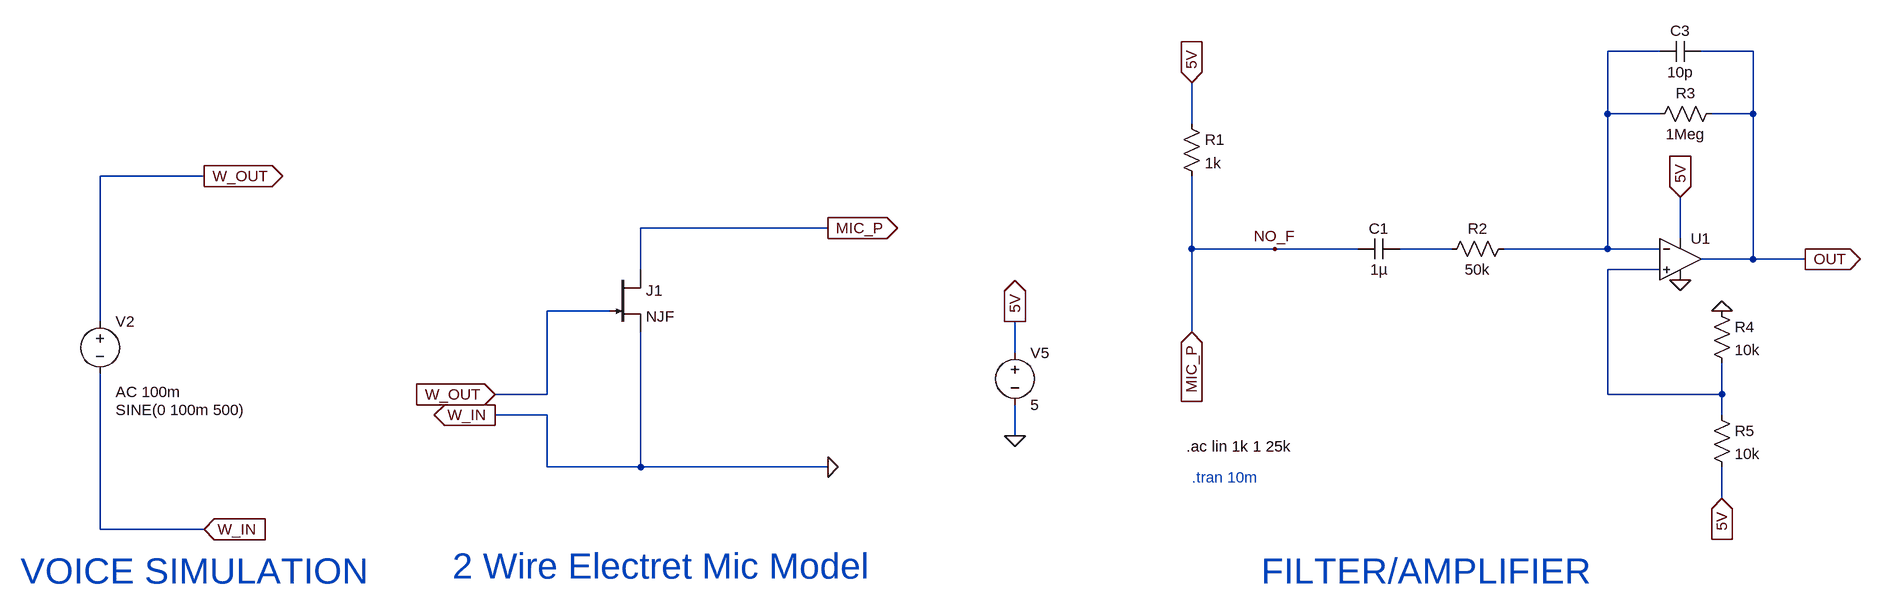
[diagram p0: schematic project_full.asc]
project_full.asc, the LTspice schematic file:
Version 4
SHEET 1 1836 680
WIRE 928 -272 848 -272
WIRE 1072 -272 992 -272
WIRE 848 -176 848 -272
WIRE 928 -176 848 -176
WIRE 1072 -176 1072 -272
WIRE 1072 -176 1008 -176
WIRE 208 -160 208 -224
WIRE -1312 -80 -1472 -80
WIRE -352 0 -640 0
WIRE 960 16 960 -48
WIRE 208 32 208 -80
WIRE 336 32 208 32
WIRE 464 32 336 32
WIRE 608 32 528 32
WIRE 848 32 848 -176
WIRE 848 32 688 32
WIRE 928 32 848 32
WIRE 1072 48 1072 -176
WIRE 1072 48 992 48
WIRE 1152 48 1072 48
WIRE -640 64 -640 0
WIRE 928 64 848 64
WIRE -688 128 -784 128
WIRE -1472 144 -1472 -80
WIRE 208 160 208 32
WIRE -64 192 -64 144
WIRE -784 256 -784 128
WIRE -784 256 -864 256
WIRE 848 256 848 64
WIRE 1024 256 1024 208
WIRE 1024 256 848 256
WIRE -784 288 -864 288
WIRE 1024 288 1024 256
WIRE -64 320 -64 272
WIRE -784 368 -784 288
WIRE -640 368 -640 160
WIRE -640 368 -784 368
WIRE -352 368 -640 368
WIRE 1024 416 1024 368
WIRE -1472 464 -1472 224
WIRE -1312 464 -1472 464
FLAG -352 368 0
FLAG 208 -224 5V
IOPIN 208 -224 In
FLAG -352 0 MIC_P
IOPIN -352 0 Out
FLAG 208 160 MIC_P
IOPIN 208 160 In
FLAG 960 80 0
FLAG 960 -48 5V
IOPIN 960 -48 In
FLAG 1152 48 OUT
IOPIN 1152 48 Out
FLAG 1024 128 0
FLAG 1024 416 5V
IOPIN 1024 416 In
FLAG -1312 464 W_IN
IOPIN -1312 464 In
FLAG -1312 -80 W_OUT
IOPIN -1312 -80 Out
FLAG -864 256 W_OUT
IOPIN -864 256 In
FLAG -864 288 W_IN
IOPIN -864 288 Out
FLAG -64 144 5V
IOPIN -64 144 Out
FLAG 336 32 NO_F
FLAG -64 320 0
SYMBOL njf -688 64 R0
SYMATTR InstName J1
SYMBOL res 192 -176 R0
SYMATTR InstName R1
SYMATTR Value 1k
SYMBOL OpAmps\\UniversalOpAmp 960 48 R0
SYMATTR InstName U1
SYMBOL res 1024 -192 R90
WINDOW 0 0 56 VBottom 2
WINDOW 3 32 56 VTop 2
SYMATTR InstName R3
SYMATTR Value 1Meg
SYMBOL cap 992 -288 R90
WINDOW 0 0 32 VBottom 2
WINDOW 3 32 32 VTop 2
SYMATTR InstName C3
SYMATTR Value 10p
SYMBOL res 1008 112 R0
SYMATTR InstName R4
SYMATTR Value 10k
SYMBOL res 1008 272 R0
SYMATTR InstName R5
SYMATTR Value 10k
SYMBOL voltage -64 176 R0
WINDOW 123 0 0 Left 0
WINDOW 39 0 0 Left 0
SYMATTR InstName V5
SYMATTR Value 5
SYMBOL voltage -1472 128 R0
WINDOW 3 24 152 Left 2
WINDOW 123 24 124 Left 2
WINDOW 39 0 0 Left 0
SYMATTR Value SINE(0 100m 500)
SYMATTR Value2 AC 100m
SYMATTR InstName V2
SYMBOL cap 528 16 R90
WINDOW 0 0 32 VBottom 2
WINDOW 3 32 32 VTop 2
SYMATTR InstName C1
SYMATTR Value 1µ
SYMBOL res 704 16 R90
WINDOW 0 0 56 VBottom 2
WINDOW 3 32 56 VTop 2
SYMATTR InstName R2
SYMATTR Value 50k
TEXT -608 520 Center 5 ;2 Wire Electret Mic Model
TEXT -1328 528 Center 5 ;VOICE SIMULATION
TEXT 568 528 Center 5 ;FILTER/AMPLIFIER
TEXT 200 336 Left 2 !.ac lin 1k 1 25k
TEXT 208 384 Left 2 ;.tran 10m

The netlist it stands for:
* project_full.asc
J1 NO_F W_OUT 0 NJF
R1 5V NO_F 1k
XU1 N003 N001 5V 0 OUT level1 Avol=1Meg GBW=10Meg Vos=0 En=0 Enk=0 In=0 Ink=0 Rin=500Meg  ; pins In+ In- V+ V- OUT
R3 OUT N001 1Meg
C3 OUT N001 10p
R4 0 N003 10k
R5 N003 5V 10k
V5 5V 0 5
V2 W_OUT 0 SINE(0 100m 500) AC 100m
C1 N002 NO_F 1µ
R2 N001 N002 50k
.model NJF NJF
.model PJF PJF
.lib standard.jft
* 2 Wire Electret Mic Model
* VOICE SIMULATION
* FILTER/AMPLIFIER
.ac lin 1k 1 25k
* .tran 10m
.lib UniversalOpAmp1.lib
.backanno
.end